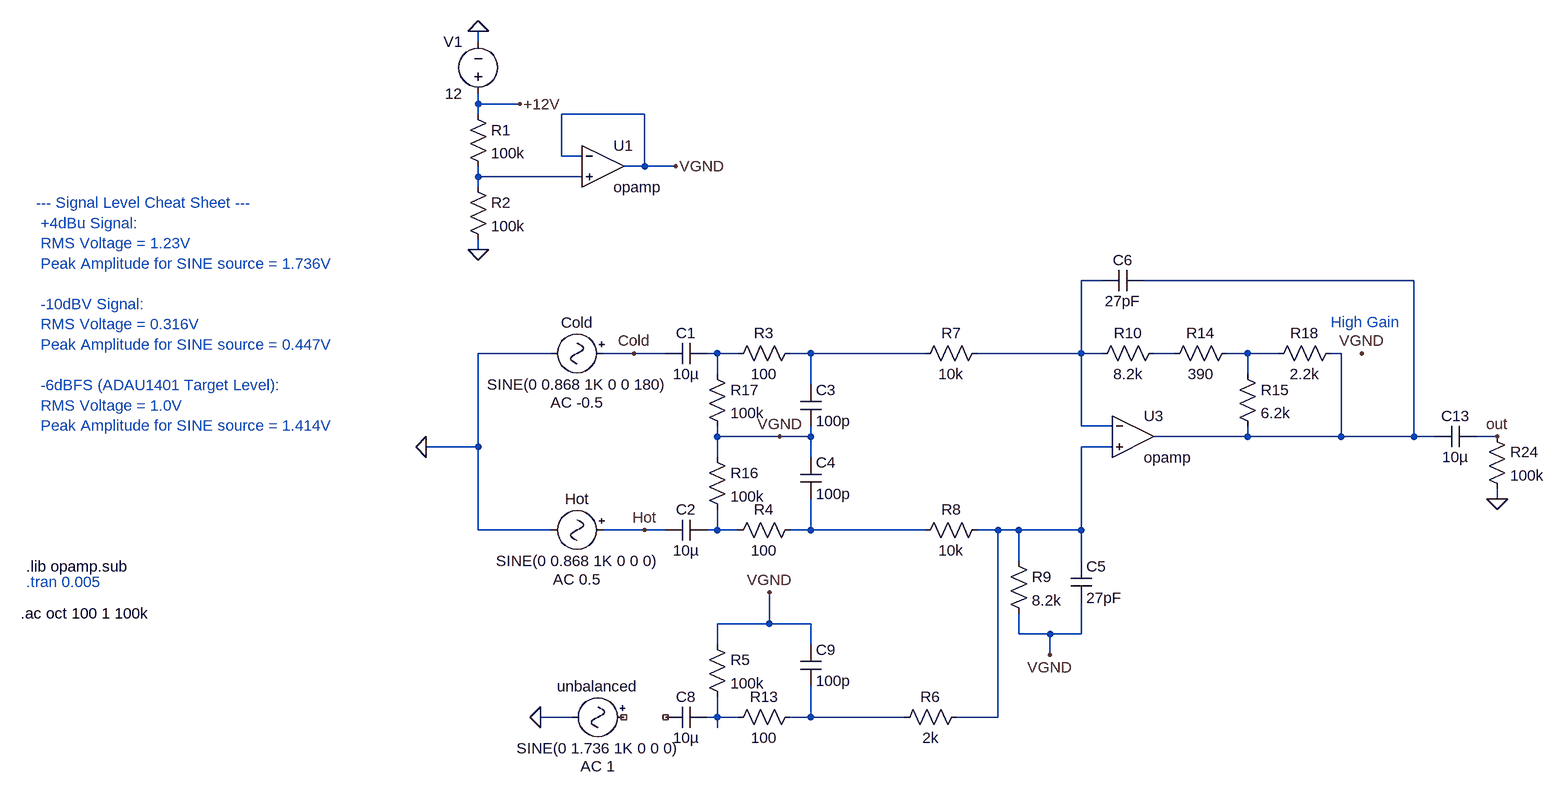
[diagram p0: schematic Input Interface.asc]
Input Interface.asc, the LTspice schematic file:
Version 4.1
SHEET 1 2576 916
WIRE -160 -336 -160 -352
WIRE -160 -240 -160 -256
WIRE -96 -240 -160 -240
WIRE -160 -224 -160 -240
WIRE 96 -224 -32 -224
WIRE -32 -160 -32 -224
WIRE 0 -160 -32 -160
WIRE 96 -144 96 -224
WIRE 96 -144 64 -144
WIRE 144 -144 96 -144
WIRE -160 -128 -160 -144
WIRE 0 -128 -160 -128
WIRE -160 -112 -160 -128
WIRE -160 -16 -160 -32
WIRE 800 32 768 32
WIRE 1280 32 864 32
WIRE -48 144 -160 144
WIRE 80 144 32 144
WIRE 128 144 80 144
WIRE 208 144 192 144
WIRE 240 144 208 144
WIRE 352 144 320 144
WIRE 528 144 352 144
WIRE 768 144 768 32
WIRE 768 144 608 144
WIRE 800 144 768 144
WIRE 912 144 880 144
WIRE 1024 144 992 144
WIRE 1072 144 1024 144
WIRE 1168 144 1152 144
WIRE 208 176 208 144
WIRE 1024 176 1024 144
WIRE 352 192 352 144
WIRE 768 256 768 144
WIRE 816 256 768 256
WIRE 208 272 208 256
WIRE 304 272 208 272
WIRE 352 272 352 256
WIRE 352 272 304 272
WIRE 1024 272 1024 256
WIRE 1024 272 880 272
WIRE 1168 272 1168 144
WIRE 1168 272 1024 272
WIRE 1280 272 1280 32
WIRE 1280 272 1168 272
WIRE 1312 272 1280 272
WIRE 1408 272 1376 272
WIRE -160 288 -160 144
WIRE -160 288 -240 288
WIRE 816 288 768 288
WIRE 208 304 208 272
WIRE 352 304 352 272
WIRE 1408 368 1408 352
WIRE -160 416 -160 288
WIRE -48 416 -160 416
WIRE 96 416 32 416
WIRE 128 416 96 416
WIRE 208 416 208 384
WIRE 208 416 192 416
WIRE 240 416 208 416
WIRE 352 416 352 368
WIRE 352 416 320 416
WIRE 528 416 352 416
WIRE 640 416 608 416
WIRE 672 416 640 416
WIRE 768 416 768 288
WIRE 768 416 672 416
WIRE 672 464 672 416
WIRE 768 464 768 416
WIRE 288 560 288 512
WIRE 288 560 208 560
WIRE 352 560 288 560
WIRE 672 576 672 544
WIRE 720 576 672 576
WIRE 768 576 768 528
WIRE 768 576 720 576
WIRE 208 592 208 560
WIRE 352 592 352 560
WIRE 720 608 720 576
WIRE -16 704 -64 704
WIRE 208 704 208 672
WIRE 208 704 192 704
WIRE 240 704 208 704
WIRE 352 704 352 656
WIRE 352 704 320 704
WIRE 496 704 352 704
WIRE 640 704 640 416
WIRE 640 704 576 704
WIRE 208 720 208 704
FLAG -160 -352 0
FLAG -160 -16 0
FLAG 144 -144 VGND
FLAG 80 144 Cold
FLAG -240 288 0
FLAG -64 704 0
FLAG 304 272 VGND
FLAG -96 -240 +12V
FLAG 96 416 Hot
FLAG 1200 144 VGND
FLAG 1408 368 0
FLAG 720 608 VGND
FLAG 288 512 VGND
FLAG 1408 272 out
SYMBOL OpAmps\\opamp 32 -208 R0
SYMATTR InstName U1
SYMBOL voltage -160 -240 R180
WINDOW 0 24 96 Left 2
WINDOW 3 24 16 Left 2
WINDOW 123 0 0 Left 0
WINDOW 39 0 0 Left 0
SYMATTR InstName V1
SYMATTR Value 12
SYMBOL res -176 -240 R0
SYMATTR InstName R1
SYMATTR Value 100k
SYMBOL res -176 -128 R0
SYMATTR InstName R2
SYMATTR Value 100k
SYMBOL Misc\\signal 48 144 R90
WINDOW 0 -32 56 VBottom 2
WINDOW 3 32 56 VTop 2
WINDOW 123 60 56 VTop 2
WINDOW 39 0 0 Left 0
SYMATTR InstName Cold
SYMATTR Value SINE(0 0.868 1K 0 0 180)
SYMATTR Value2 AC -0.5
SYMBOL Misc\\signal 48 416 R90
WINDOW 0 -32 56 VBottom 2
WINDOW 3 32 56 VTop 2
WINDOW 123 60 56 VTop 2
WINDOW 39 0 0 Left 0
SYMATTR InstName Hot
SYMATTR Value SINE(0 0.868 1K 0 0 0)
SYMATTR Value2 AC 0.5
SYMBOL Misc\\signal 80 704 R90
WINDOW 0 -32 56 VBottom 2
WINDOW 3 32 56 VTop 2
WINDOW 123 60 56 VTop 2
WINDOW 39 0 0 Left 0
SYMATTR InstName unbalanced
SYMATTR Value SINE(0 1.736 1K 0 0 0)
SYMATTR Value2 AC 1
SYMBOL cap 192 128 R90
WINDOW 0 0 32 VBottom 2
WINDOW 3 32 32 VTop 2
SYMATTR InstName C1
SYMATTR Value 10µ
SYMATTR SpiceLine V=35
SYMBOL cap 192 400 R90
WINDOW 0 0 32 VBottom 2
WINDOW 3 32 32 VTop 2
SYMATTR InstName C2
SYMATTR Value 10µ
SYMATTR SpiceLine V=35
SYMBOL res 336 128 R90
WINDOW 0 0 56 VBottom 2
WINDOW 3 32 56 VTop 2
SYMATTR InstName R3
SYMATTR Value 100
SYMBOL res 336 400 R90
WINDOW 0 0 56 VBottom 2
WINDOW 3 32 56 VTop 2
SYMATTR InstName R4
SYMATTR Value 100
SYMBOL cap 336 192 R0
SYMATTR InstName C3
SYMATTR Value 100p
SYMBOL cap 336 304 R0
SYMATTR InstName C4
SYMATTR Value 100p
SYMBOL res 624 128 R90
WINDOW 0 0 56 VBottom 2
WINDOW 3 32 56 VTop 2
SYMATTR InstName R7
SYMATTR Value 10k
SYMBOL res 624 400 R90
WINDOW 0 0 56 VBottom 2
WINDOW 3 32 56 VTop 2
SYMATTR InstName R8
SYMATTR Value 10k
SYMBOL res 656 448 R0
SYMATTR InstName R9
SYMATTR Value 8.2k
SYMBOL cap 752 464 R0
SYMATTR InstName C5
SYMATTR Value 27pF
SYMBOL res 896 128 R90
WINDOW 0 0 56 VBottom 2
WINDOW 3 32 56 VTop 2
SYMATTR InstName R10
SYMATTR Value 8.2k
SYMBOL cap 864 16 R90
WINDOW 0 0 32 VBottom 2
WINDOW 3 32 32 VTop 2
SYMATTR InstName C6
SYMATTR Value 27pF
SYMBOL OpAmps\\opamp 848 208 R0
SYMATTR InstName U3
SYMBOL cap 192 688 R90
WINDOW 0 0 32 VBottom 2
WINDOW 3 32 32 VTop 2
SYMATTR InstName C8
SYMATTR Value 10µ
SYMATTR SpiceLine V=35
SYMBOL res 336 688 R90
WINDOW 0 0 56 VBottom 2
WINDOW 3 32 56 VTop 2
SYMATTR InstName R13
SYMATTR Value 100
SYMBOL cap 336 592 R0
SYMATTR InstName C9
SYMATTR Value 100p
SYMBOL res 192 288 R0
SYMATTR InstName R16
SYMATTR Value 100k
SYMBOL res 192 160 R0
SYMATTR InstName R17
SYMATTR Value 100k
SYMBOL res 192 576 R0
SYMATTR InstName R5
SYMATTR Value 100k
SYMBOL res 592 688 R90
WINDOW 0 0 56 VBottom 2
WINDOW 3 32 56 VTop 2
SYMATTR InstName R6
SYMATTR Value 2k
SYMBOL res 1008 128 R90
WINDOW 0 0 56 VBottom 2
WINDOW 3 32 56 VTop 2
SYMATTR InstName R14
SYMATTR Value 390
SYMBOL res 1008 160 R0
SYMATTR InstName R15
SYMATTR Value 6.2k
SYMBOL res 1168 128 R90
WINDOW 0 0 56 VBottom 2
WINDOW 3 32 56 VTop 2
SYMATTR InstName R18
SYMATTR Value 2.2k
SYMBOL cap 1376 256 R90
WINDOW 0 0 32 VBottom 2
WINDOW 3 32 32 VTop 2
SYMATTR InstName C13
SYMATTR Value 10µ
SYMATTR SpiceLine V=35
SYMBOL res 1392 256 R0
SYMATTR InstName R24
SYMATTR Value 100k
TEXT -856 472 Left 2 !.lib opamp.sub
TEXT -856 496 Left 2 ;.tran 0.005
TEXT -840 -88 Left 2 ;--- Signal Level Cheat Sheet ---\n +4dBu Signal:\n RMS Voltage = 1.23V\n Peak Amplitude for SINE source = 1.736V\n \n -10dBV Signal:\n RMS Voltage = 0.316V\n Peak Amplitude for SINE source = 0.447V\n \n -6dBFS (ADAU1401 Target Level):\n RMS Voltage = 1.0V\n Peak Amplitude for SINE source = 1.414V
TEXT -864 544 Left 2 !.ac oct 100 1 100k
TEXT 1152 96 Left 2 ;High Gain

The netlist it stands for:
* Input Interface.asc
X§U1 VGND N001 VGND opamp Aol=100K GBW=10Meg  ; pins invin noninvin out
V1 +12V 0 12
R1 +12V N001 100k
R2 N001 0 100k
V§Cold Cold 0 SINE(0 0.868 1K 0 0 180) AC -0.5
V§Hot Hot 0 SINE(0 0.868 1K 0 0 0) AC 0.5
V§unbalanced NC_01 0 SINE(0 1.736 1K 0 0 0) AC 1
C1 N004 Cold 10µ V=35
C2 N009 Hot 10µ V=35
R3 N005 N004 100
R4 N010 N009 100
C3 N005 VGND 100p
C4 VGND N010 100p
R7 N002 N005 10k
R8 N008 N010 10k
R9 N008 VGND 8.2k
C5 N008 VGND 27pF
R10 N006 N002 8.2k
C6 N003 N002 27pF
X§U3 N002 N008 N003 opamp Aol=100K GBW=10Meg  ; pins invin noninvin out
C8 N011 NC_02 10µ V=35
R13 N012 N011 100
C9 VGND N012 100p
R16 VGND N009 100k
R17 N004 VGND 100k
R5 VGND N011 100k
R6 N008 N012 2k
R14 N007 N006 390
R15 N007 N003 6.2k
R18 N003 N007 2.2k
C13 out N003 10µ V=35
R24 out 0 100k
.lib opamp.sub
* .tran 0.005
* --- Signal Level Cheat Sheet ---
*  +4dBu Signal:
*  RMS Voltage = 1.23V
*  Peak Amplitude for SINE source = 1.736V
*  -10dBV Signal:
*  RMS Voltage = 0.316V
*  Peak Amplitude for SINE source = 0.447V
*  -6dBFS (ADAU1401 Target Level):
*  RMS Voltage = 1.0V
*  Peak Amplitude for SINE source = 1.414V
.ac oct 100 1 100k
* High Gain
.backanno
.end